# Altium schematic sheet PCA9685.SchDoc
size A4
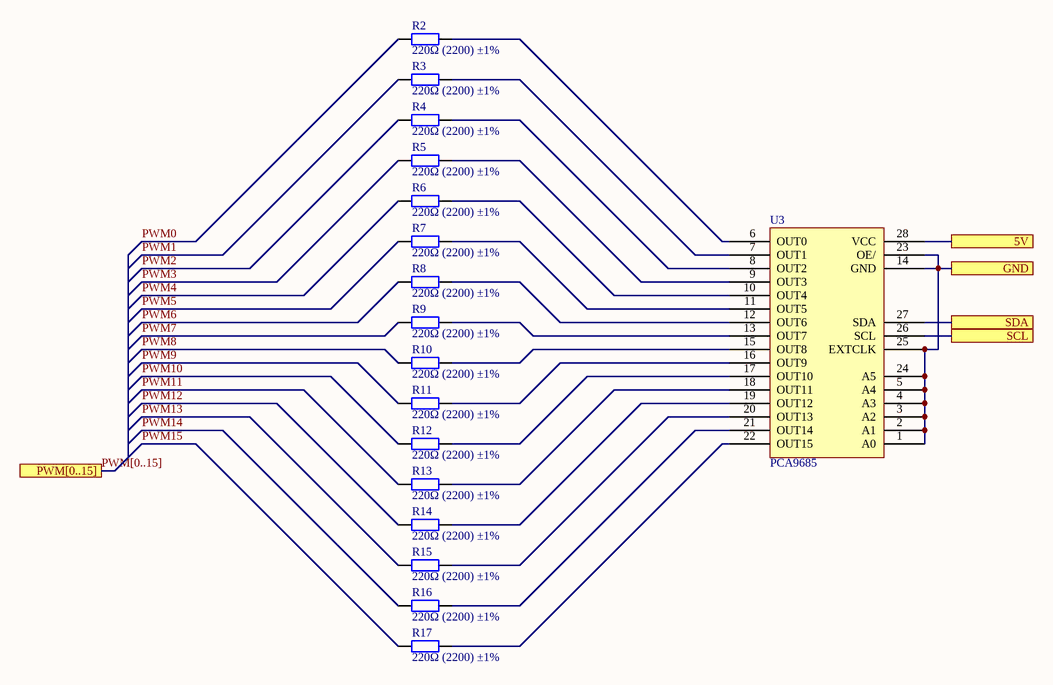
[diagram p0: PCA9685.SchDoc]

## Parts
R2  220Ω (2200) ±1%  [0402_R]
R3  220Ω (2200) ±1%  [0402_R]
R4  220Ω (2200) ±1%  [0402_R]
R5  220Ω (2200) ±1%  [0402_R]
R6  220Ω (2200) ±1%  [0402_R]
R7  220Ω (2200) ±1%  [0402_R]
R8  220Ω (2200) ±1%  [0402_R]
R9  220Ω (2200) ±1%  [0402_R]
R10  220Ω (2200) ±1%  [0402_R]
R11  220Ω (2200) ±1%  [0402_R]
R12  220Ω (2200) ±1%  [0402_R]
R13  220Ω (2200) ±1%  [0402_R]
R14  220Ω (2200) ±1%  [0402_R]
R15  220Ω (2200) ±1%  [0402_R]
R16  220Ω (2200) ±1%  [0402_R]
R17  220Ω (2200) ±1%  [0402_R]
U3  PCA9685  [TSSOP28_M]

## Ports
5V, GND, PWM[0..15], SCL, SDA

## Nets
5V: U3.28(VCC) ; port 5V
GND: U3.1(A0) U3.2(A1) U3.3(A2) U3.4(A3) U3.5(A4) U3.14(GND) U3.23(OE/) U3.24(A5) U3.25(EXTCLK) ; port GND
PWM0: R2.1
PWM1: R3.1
PWM2: R4.1
PWM3: R5.1
PWM4: R6.1
PWM5: R7.1
PWM6: R8.1
PWM7: R9.1
PWM8: R10.1
PWM9: R11.1
PWM10: R12.1
PWM11: R13.1
PWM12: R14.1
PWM13: R15.1
PWM14: R16.1
PWM15: R17.1
SCL: U3.26(SCL) ; port SCL
SDA: U3.27(SDA) ; port SDA
NetR2_2: R2.2 U3.6(OUT0)
NetR3_2: R3.2 U3.7(OUT1)
NetR4_2: R4.2 U3.8(OUT2)
NetR5_2: R5.2 U3.9(OUT3)
NetR6_2: R6.2 U3.10(OUT4)
NetR7_2: R7.2 U3.11(OUT5)
NetR8_2: R8.2 U3.12(OUT6)
NetR9_2: R9.2 U3.13(OUT7)
NetR10_2: R10.2 U3.15(OUT8)
NetR11_2: R11.2 U3.16(OUT9)
NetR12_2: R12.2 U3.17(OUT10)
NetR13_2: R13.2 U3.18(OUT11)
NetR14_2: R14.2 U3.19(OUT12)
NetR15_2: R15.2 U3.20(OUT13)
NetR16_2: R16.2 U3.21(OUT14)
NetR17_2: R17.2 U3.22(OUT15)

## Buses and harness runs
bus PWM[0..15] = port PWM[0..15]

## Library data of the parts
R2-R17 = 0402 220Ω (2200) 1%: 贴片电阻; ComponentLink1Description: 供应商链接; ComponentLink1URL: http://www.szlcsc.com/product/details_25834.html; Package: 0402; Supplier: LC; SuppliersPartNumber: C25091
U3 = PCA9685: 16-channel, 12-bit PWM Fm+ I2C-bus LED controller